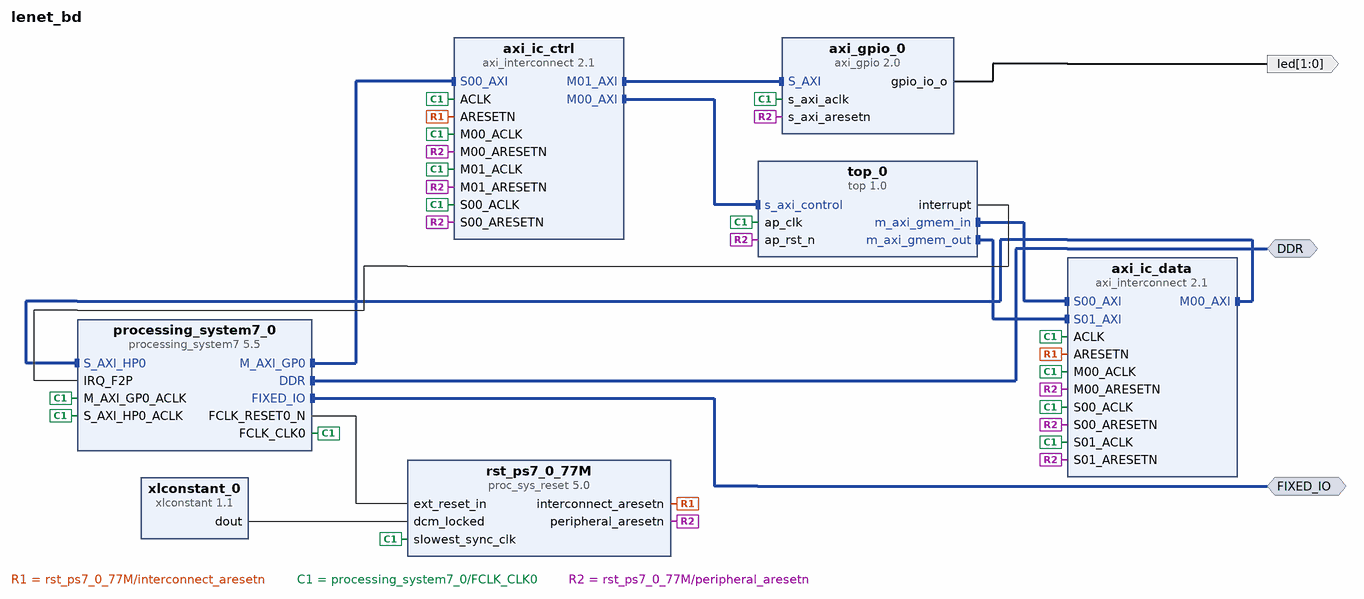
[diagram p0: block diagram of the top level]
# Vivado block design lenet_bd, xc7z020clg400-1, Vivado 2025.1
create_bd_design lenet_bd

create_bd_intf_port -mode Master -vlnv xilinx.com:interface:ddrx_rtl:1.0 DDR
create_bd_intf_port -mode Master -vlnv xilinx.com:display_processing_system7:fixedio_rtl:1.0 FIXED_IO
create_bd_port -dir O -from 1 -to 0 led

create_bd_cell -type ip -vlnv xilinx.com:ip:processing_system7:5.5 processing_system7_0
set_property -dict [list \
  CONFIG.PCW_FPGA0_PERIPHERAL_FREQMHZ 78 \
  CONFIG.PCW_IRQ_F2P_INTR 1 \
  CONFIG.PCW_USE_FABRIC_INTERRUPT 1 \
  CONFIG.PCW_USE_S_AXI_HP0 1 \
] [get_bd_cells processing_system7_0]
# 30 more settings of processing_system7_0 are not shown: defaults, MIO pin electricals, DDR timing, and values the tool derives
create_bd_cell -type ip -vlnv xilinx.com:ip:proc_sys_reset:5.0 rst_ps7_0_77M
create_bd_cell -type ip -vlnv xilinx.com:ip:axi_gpio:2.0 axi_gpio_0
set_property -dict [list \
  CONFIG.C_ALL_INPUTS 0 \
  CONFIG.C_ALL_OUTPUTS 1 \
  CONFIG.C_GPIO_WIDTH 2 \
  CONFIG.C_IS_DUAL 0 \
] [get_bd_cells axi_gpio_0]
create_bd_cell -type ip -vlnv xilinx.com:ip:xlconstant:1.1 xlconstant_0
create_bd_cell -type ip -vlnv xilinx.com:ip:axi_interconnect:2.1 axi_ic_ctrl
set_property -dict {CONFIG.M00_HAS_REGSLICE 1 CONFIG.M01_HAS_REGSLICE 1 CONFIG.S00_HAS_REGSLICE 1} [get_bd_cells axi_ic_ctrl]
create_bd_cell -type ip -vlnv xilinx.com:ip:axi_interconnect:2.1 axi_ic_data
set_property -dict [list \
  CONFIG.M00_HAS_REGSLICE 1 \
  CONFIG.NUM_MI 1 \
  CONFIG.NUM_SI 2 \
  CONFIG.S00_HAS_REGSLICE 1 \
  CONFIG.S01_HAS_REGSLICE 1 \
] [get_bd_cells axi_ic_data]
create_bd_cell -type ip -vlnv xilinx.com:hls:top:1.0 top_0

# ---- connections ----

connect_bd_intf_net [get_bd_intf_pins axi_ic_ctrl/M00_AXI] [get_bd_intf_pins top_0/s_axi_control]
connect_bd_intf_net [get_bd_intf_pins axi_ic_data/M00_AXI] [get_bd_intf_pins processing_system7_0/S_AXI_HP0]
connect_bd_intf_net -intf_net axi_interconnect_0_M01_AXI [get_bd_intf_pins axi_ic_ctrl/M01_AXI] [get_bd_intf_pins axi_gpio_0/S_AXI]
connect_bd_intf_net [get_bd_intf_ports DDR] [get_bd_intf_pins processing_system7_0/DDR]
connect_bd_intf_net [get_bd_intf_ports FIXED_IO] [get_bd_intf_pins processing_system7_0/FIXED_IO]
connect_bd_intf_net [get_bd_intf_pins processing_system7_0/M_AXI_GP0] [get_bd_intf_pins axi_ic_ctrl/S00_AXI]
connect_bd_intf_net [get_bd_intf_pins top_0/m_axi_gmem_in] [get_bd_intf_pins axi_ic_data/S00_AXI]
connect_bd_intf_net [get_bd_intf_pins top_0/m_axi_gmem_out] [get_bd_intf_pins axi_ic_data/S01_AXI]
connect_bd_net -net ARESETN_1 [get_bd_pins rst_ps7_0_77M/interconnect_aresetn] [get_bd_pins axi_ic_ctrl/ARESETN] [get_bd_pins axi_ic_data/ARESETN]
connect_bd_net [get_bd_pins axi_gpio_0/gpio_io_o] [get_bd_ports led]
connect_bd_net [get_bd_pins processing_system7_0/FCLK_CLK0] \
  [get_bd_pins processing_system7_0/M_AXI_GP0_ACLK] [get_bd_pins rst_ps7_0_77M/slowest_sync_clk] \
  [get_bd_pins processing_system7_0/S_AXI_HP0_ACLK] [get_bd_pins axi_gpio_0/s_axi_aclk] [get_bd_pins axi_ic_ctrl/ACLK] \
  [get_bd_pins axi_ic_data/ACLK] [get_bd_pins axi_ic_ctrl/M00_ACLK] [get_bd_pins axi_ic_ctrl/M01_ACLK] \
  [get_bd_pins axi_ic_ctrl/S00_ACLK] [get_bd_pins axi_ic_data/M00_ACLK] [get_bd_pins axi_ic_data/S00_ACLK] \
  [get_bd_pins top_0/ap_clk] [get_bd_pins axi_ic_data/S01_ACLK]
connect_bd_net [get_bd_pins processing_system7_0/FCLK_RESET0_N] [get_bd_pins rst_ps7_0_77M/ext_reset_in]
connect_bd_net [get_bd_pins rst_ps7_0_77M/peripheral_aresetn] \
  [get_bd_pins axi_gpio_0/s_axi_aresetn] [get_bd_pins axi_ic_ctrl/M00_ARESETN] [get_bd_pins axi_ic_ctrl/M01_ARESETN] \
  [get_bd_pins axi_ic_ctrl/S00_ARESETN] [get_bd_pins axi_ic_data/M00_ARESETN] [get_bd_pins axi_ic_data/S00_ARESETN] \
  [get_bd_pins top_0/ap_rst_n] [get_bd_pins axi_ic_data/S01_ARESETN]
connect_bd_net [get_bd_pins top_0/interrupt] [get_bd_pins processing_system7_0/IRQ_F2P]
connect_bd_net [get_bd_pins xlconstant_0/dout] [get_bd_pins rst_ps7_0_77M/dcm_locked]

# ---- address map ----
assign_bd_address -offset 0x40000000 -range 64K -target_address_space [get_bd_addr_spaces processing_system7_0/Data] [get_bd_addr_segs top_0/s_axi_control/Reg]
assign_bd_address -offset 0x40010000 -range 64K -target_address_space [get_bd_addr_spaces processing_system7_0/Data] [get_bd_addr_segs axi_gpio_0/S_AXI/Reg]
exclude_bd_addr_seg -offset 0x00000000 -range 1 -target_address_space [get_bd_addr_spaces processing_system7_0/Data] [get_bd_addr_segs processing_system7_0/S_AXI_HP0/HP0_DDR_LOWOCM]
assign_bd_address -offset 0x0000000000000000 -range 512M -target_address_space [get_bd_addr_spaces top_0/Data_m_axi_gmem_in] [get_bd_addr_segs processing_system7_0/S_AXI_HP0/HP0_DDR_LOWOCM]
assign_bd_address -offset 0x0000000000000000 -range 512M -target_address_space [get_bd_addr_spaces top_0/Data_m_axi_gmem_out] [get_bd_addr_segs processing_system7_0/S_AXI_HP0/HP0_DDR_LOWOCM]

validate_bd_design
save_bd_design
